# EasyEDA Pro project ProProject_BUCK_t1_3_2024-04-06.epro

# Schematic Schematic1
Create Date: 2024-04-03; Page Name: P1; Project Name: BUCK_t1_3; Schematic Name: Schematic1; Update Date: 2024-04-03; Company: 嘉立创EDA; Page Size: A3; Version: V1.0
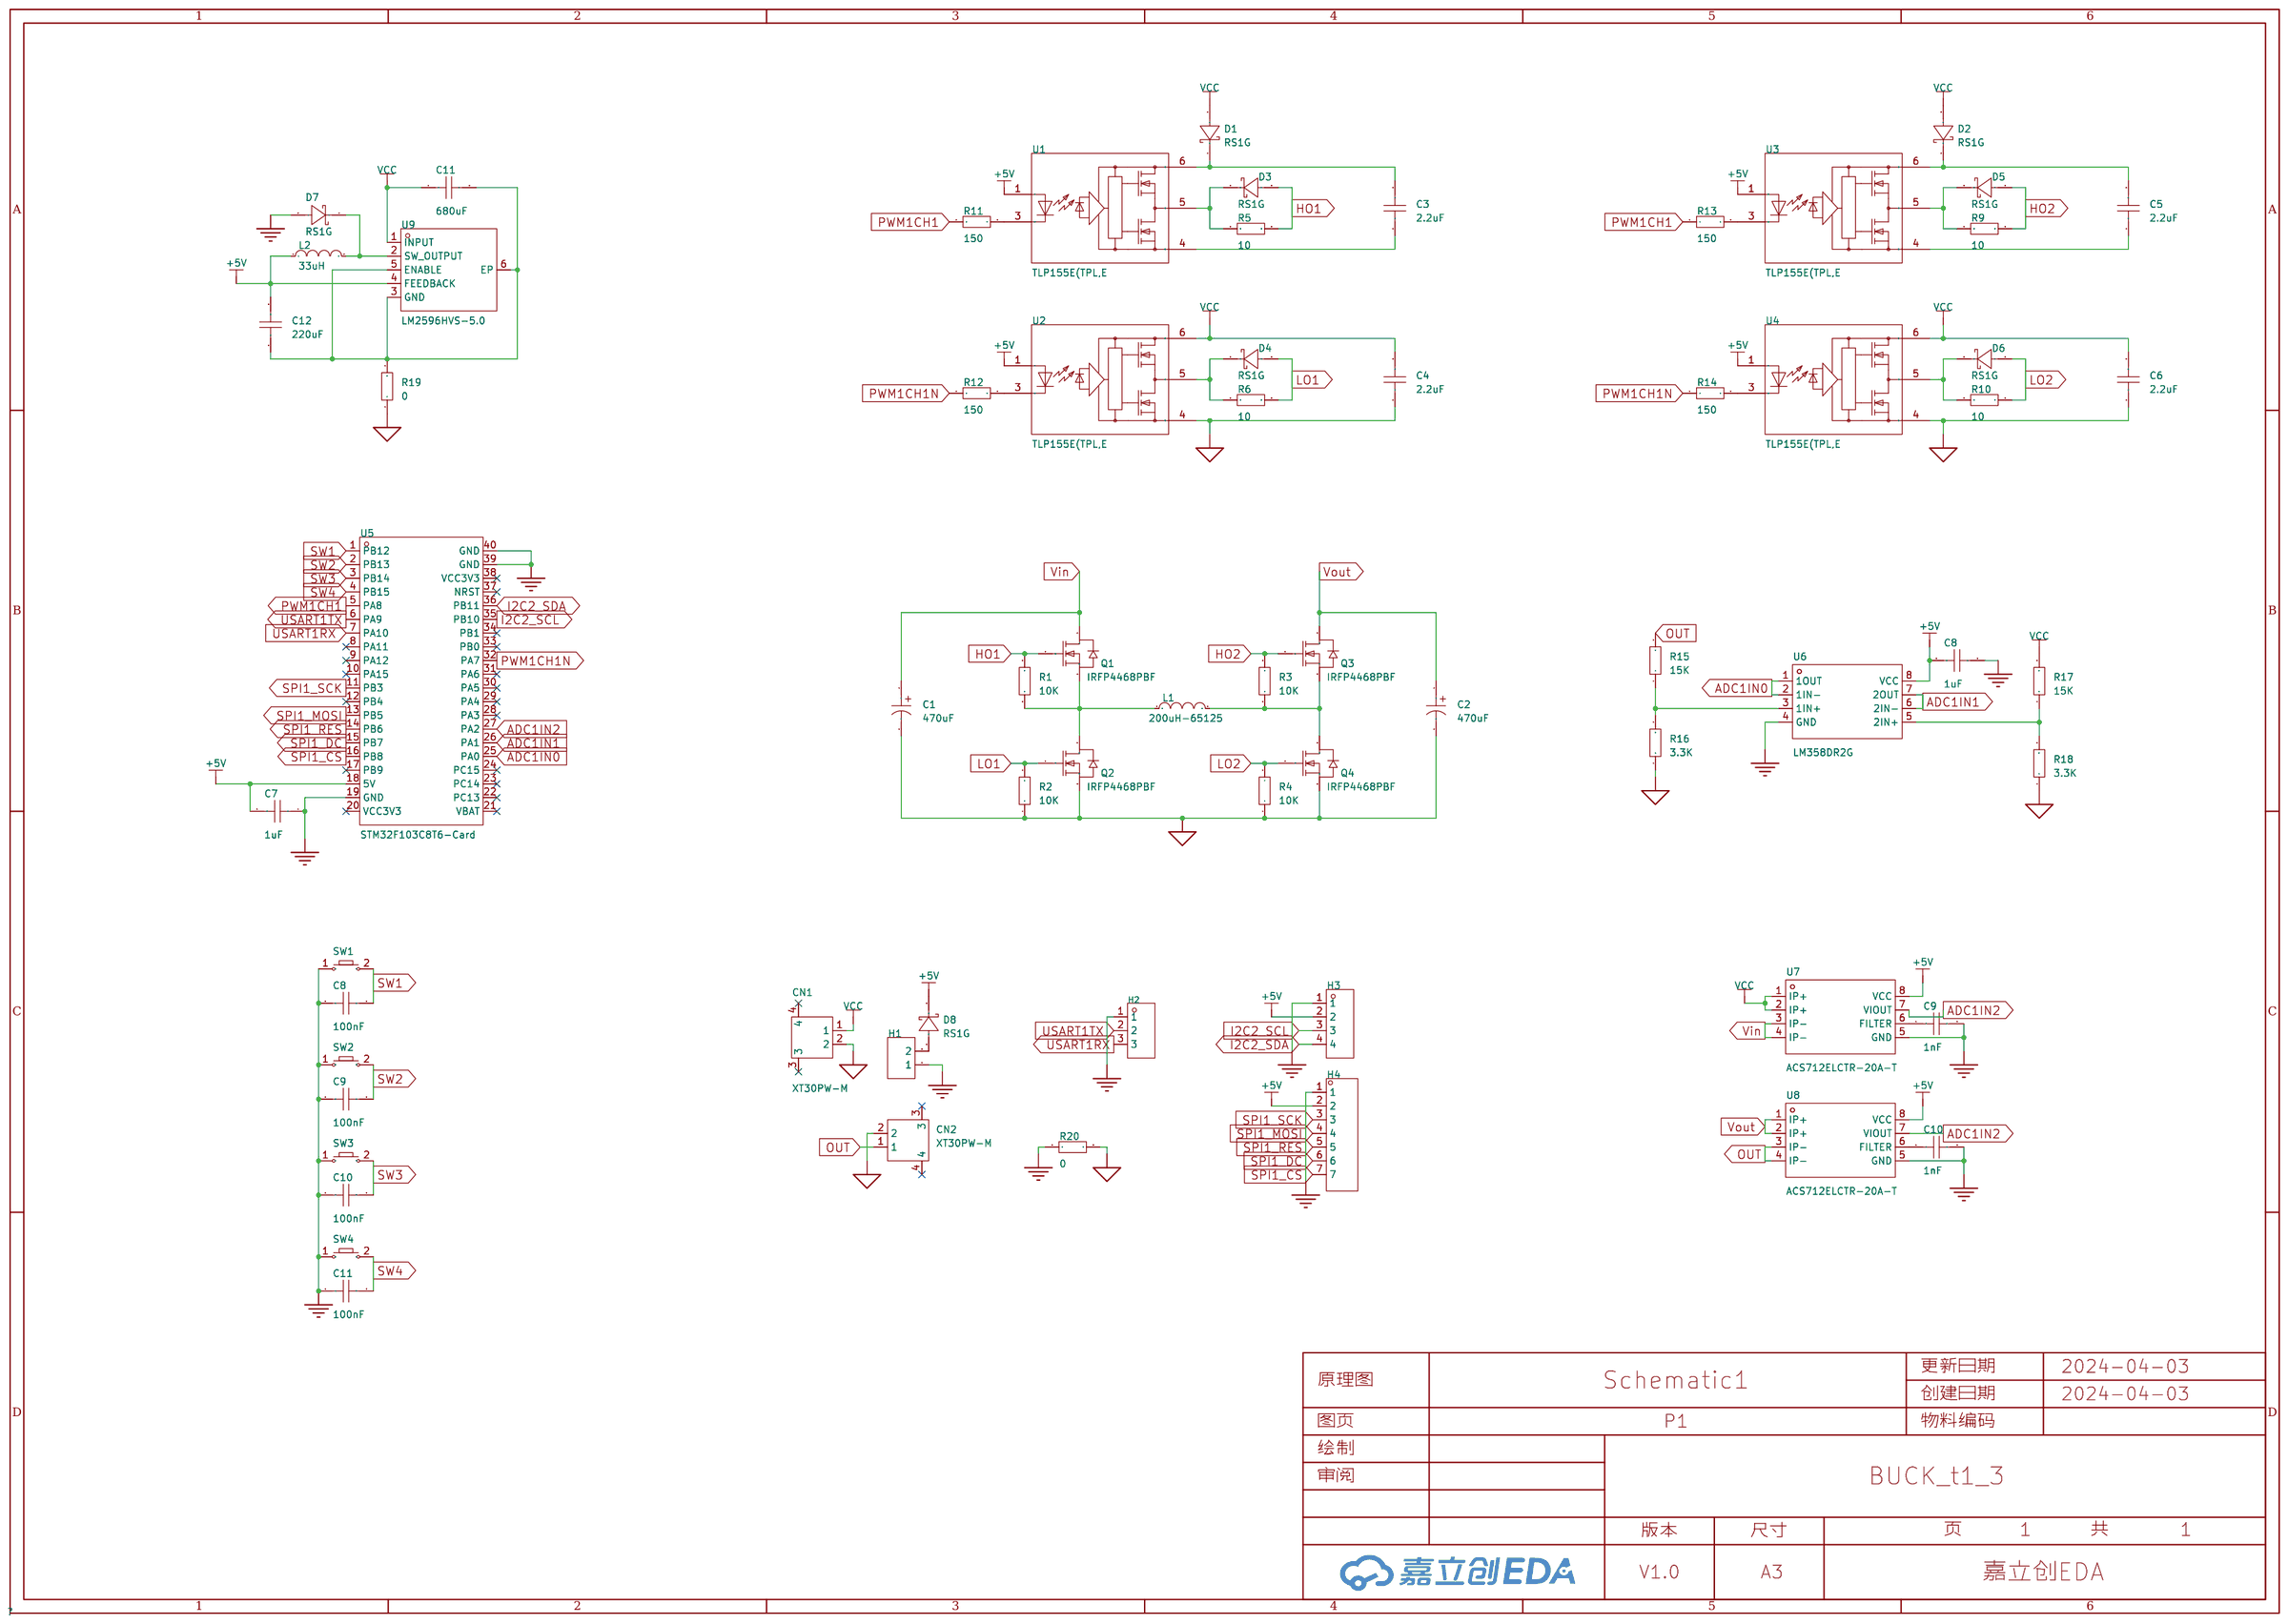
[diagram p0: schematic sheet]

## Parts
C1  470uF  [CAP-TH_BD16.0-P7.50-D1.5-FD]
C2  470uF  [CAP-TH_BD16.0-P7.50-D1.5-FD]
C3  2.2uF  [C0603]
C4  2.2uF  [C0603]
C5  2.2uF  [C0603]
C6  2.2uF  [C0603]
C7  1uF  [C0603]
C8  100nF  [C0603]
C8#2  1uF  [C0603]
C9  1nF  [C0603]
C9#2  100nF  [C0603]
C10  100nF  [C0603]
C10#2  1nF  [C0603]
C11  680uF  [C0603]
C11#2  100nF  [C0603]
C12  220uF  [C0603]
CN1  XT30PW-M  [CONN-TH_XT30PW-M]
CN2  XT30PW-M  [CONN-TH_XT30PW-M]
D1  RS1G  [SMA_L4.5-W2.7-LS5.0-RD]
D2  RS1G  [SMA_L4.5-W2.7-LS5.0-RD]
D3  RS1G  [SMA_L4.5-W2.7-LS5.0-RD]
D4  RS1G  [SMA_L4.5-W2.7-LS5.0-RD]
D5  RS1G  [SMA_L4.5-W2.7-LS5.0-RD]
D6  RS1G  [SMA_L4.5-W2.7-LS5.0-RD]
D7  RS1G  [SMA_L4.5-W2.7-LS5.0-RD]
D8  RS1G  [SMA_L4.5-W2.7-LS5.0-RD]
H1  -  [HDR-TH_2P-P2.54-V-F]
H2  -  [HDR-TH_3P-P2.54-V-F]
H3  -  [HDR-TH_4P-P2.54-V-F]
H4  -  [HDR-TH_7P-P2.54-V-F]
L1  200uH-65125  [IND-TH_200UH-65125]
L2  33uH  [IND-SMD_L7.3-W6.7_TMPA0605SV]
Q1  IRFP4468PBF  [TO-247AC-3_L15.8-W5.0-P5.46-L]
Q2  IRFP4468PBF  [TO-247AC-3_L15.8-W5.0-P5.46-L]
Q3  IRFP4468PBF  [TO-247AC-3_L15.8-W5.0-P5.46-L]
Q4  IRFP4468PBF  [TO-247AC-3_L15.8-W5.0-P5.46-L]
R1  10K  [R0603]
R2  10K  [R0603]
R3  10K  [R0603]
R4  10K  [R0603]
R5  10  [R0603]
R6  10  [R0603]
R9  10  [R0603]
R10  10  [R0603]
R11  150  [R0603]
R12  150  [R0603]
R13  150  [R0603]
R14  150  [R0603]
R15  15K  [R0603]
R16  3.3K  [R0603]
R17  15K  [R0603]
R18  3.3K  [R0603]
R19  0  [R0603]
R20  0  [R0603]
SW1  -  [Key_SMD_3x4x2]
SW2  -  [Key_SMD_3x4x2]
SW3  -  [Key_SMD_3x4x2]
SW4  -  [Key_SMD_3x4x2]
U1  TLP155E(TPL,E  [OPTO-SMD-5_L3.7-W4.6-P1.27-LS7.0-BR]
U2  TLP155E(TPL,E  [OPTO-SMD-5_L3.7-W4.6-P1.27-LS7.0-BR]
U3  TLP155E(TPL,E  [OPTO-SMD-5_L3.7-W4.6-P1.27-LS7.0-BR]
U4  TLP155E(TPL,E  [OPTO-SMD-5_L3.7-W4.6-P1.27-LS7.0-BR]
U5  STM32F103C8T6-Card  [CONN-TH_L53.3-W22.9_STM32F103C8T6-CARD]
U6  LM358DR2G  [SOIC-8_L5.0-W4.0-P1.27-LS6.0-BL]
U7  ACS712ELCTR-20A-T  [SOIC-8_L4.9-W3.9-P1.27-LS6.0-BL]
U8  ACS712ELCTR-20A-T  [SOIC-8_L4.9-W3.9-P1.27-LS6.0-BL]
U9  LM2596HVS-5.0  [TO-263-5_L10.0-W9.0-P1.70-LS15.0-BL]

## Library data of the parts
C1 C2 = ERS2BM471L35OT: 容值:470uF;精度:±20%;额定电压:120V;纹波电流:-;等效串联电阻:-;; LCSC Part Name: 470uF ±20% 120V; Supplier Part: C724648; Manufacturer: AISHI(艾华集团); Supplier Footprint: 插件,D16xL35mm; JLCPCB Part Class: 扩展库; Datasheet: https://atta.szlcsc.com/upload/public/pdf/source/20191015/C438940_4B8E60A742BB0AE40DDEF87A5C89089D.pdf; Supplier: LCSC; Tolerance: ±20%; Rated Voltage: 120V
C3-C8 C8#2 C9 C9#2 C10 C10#2 C11 C11#2 C12 = CAP_0603: Supplier Footprint: 0603
CN1 CN2 = XT30PW-M: 类别:-;类型1:-;; LCSC Part Name: AMASS(艾迈斯)航模插头 卧式弯脚 XT30PW-M公头; Supplier Part: C431092; Manufacturer: AMASS(艾迈斯); JLCPCB Part Class: 扩展库; Datasheet: https://atta.szlcsc.com/upload/public/pdf/source/20220222/6A9F22F7850E25B33E1BE430ADF8560B.pdf; Supplier: LCSC; Brand: 艾迈斯; Type: 航模插头; RatedVoltage: DC 500V; InterfaceType: 公头; RatedCurrent: 15A; RecommendedWireGauge: 16/18/20AWG; contact resistance: 1.2mΩ; specifications: 2pin
D1-D8 = RS1G: 正向压降(Vf):1.3V;直流反向耐压(Vr):400V;平均整流电流(Io):1A;反向恢复时间(trr):150ns;; LCSC Part Name: 电压:400V 电流:1A; Supplier Part: C3033524; Manufacturer: DIYI(迪一/芯诺); Supplier Footprint: SMA; JLCPCB Part Class: Extended Part; Datasheet: https://atta.szlcsc.com/upload/public/pdf/source/20220613/C965765CDFC32938B4D63EA677203AB8.pdf; Supplier: LCSC; Forward Voltage (Vf@If): 1.3V; Reverse Voltage (Vr): 400V; Average Rectified Current (Io): 1A; Reverse Leakage Current: 5uA; Reverse Recovery Time (trr): 150ns; Operating Temperature: -55℃~+150℃; Diode Configuration: 独立式
H1 = HDR-F_2.54_1x2P: Supplier Part: C49661; Supplier Footprint: 插件
H2 = HDR-F_2.54_1x3P: Supplier Part: C541850; Supplier Footprint: 插件
H3 = HDR-F_2.54_1x4P: Supplier Part: C2718488; Supplier Footprint: 插件
H4 = HDR-F_2.54_1x7P: Supplier Part: C124418; Supplier Footprint: 插件
L1 = 200uH-65125: Supplier Part: C9900012734; Supplier Footprint: IND-TH; JLCPCB Part Class: Extended Part; Supplier: LCSC
L2 = MGV0603330M-10: 电感值:33uH;精度:±20%;额定电流:2A;饱和电流(Isat):2.5A;类型:-;; LCSC Part Name: 33uH ±20% 2.5A; Supplier Part: C2453970; Manufacturer: Laird-Signal Integrity Products; JLCPCB Part Class: Extended Part; Datasheet: https://atta.szlcsc.com/upload/public/pdf/source/20210416/42953FF7012EE029E7A94AFFA1C1F7D2.pdf; Supplier: LCSC; Tolerance: ±20%; Rated Current: 2A; Saturation Current (Isat): 2.5A; DC Resistance (DCR): 200mΩ
Q1-Q4 = IRFP4468PBF: 类型:N沟道;漏源电压(Vdss):100V;连续漏极电流(Id):195A;功率(Pd):520W;导通电阻(RDS(on)@Vgs,Id):2.6mΩ@10V,180A;阈值电压(Vgs(th)@Id):4V@250uA;; LCSC Part Name: N沟道 耐压:100V 电流:195A; Supplier Part: C2919; Manufacturer: Infineon(英飞凌); Supplier Footprint: TO-247AC-3; JLCPCB Part Class: 扩展库; Datasheet: https://atta.szlcsc.com/upload/public/pdf/source/20200421/C513172_0206954A6A294F6A4994DAF9F319B5AC.pdf; Supplier: LCSC; Type: N沟道; Drain Source Voltage (Vdss): 100V; Continuous Drain Current (Id): 195A; Power Dissipation (Pd): 520W; Drain Source On Resistance (RDS(on)@Vgs,Id): 2.6mΩ@10V,180A; Gate Threshold Voltage (Vgs(th)@Id): 4V@250uA; Total Gate Charge (Qg@Vgs): 540nC@10V; Input Capacitance (Ciss@Vds): 19.86nF@50V; Operating Temperature: -55℃~+175℃@(Tj)
R1-R6 R9-R20 = Res_0603: Supplier Footprint: 0603
SW1-SW4 = Key_SMD_3x4x2: Supplier Footprint: SMD
U1-U4 = TLP155E(TPL,E: 输入类型:DC;电源电压:10V~30V;共模瞬变抗扰度CMTI:15kV/us;传播延迟tpLH/tpHL:170ns；170ns;; Supplier Part: C56499; Manufacturer: TOSHIBA(东芝); Supplier Footprint: SOIC-5-4.6mm; JLCPCB Part Class: 扩展库; Datasheet: https://atta.szlcsc.com/upload/public/pdf/source/20150821/1457707350132.pdf; Supplier: LCSC; Input Type: DC; Supply Voltage: 10V~30V; Common Mode Transient Immunity (CMTI): 15kV/us; Propagation Delay tpLH/tpHL: 170ns；170ns; Number of Channels: 1; Operating Temperature: -40℃~+100℃
U5 = STM32F103C8T6-Card: Supplier Part: C9900077949; Supplier Footprint: 插件; Supplier: LCSC
U6 = LM358DR2G: 放大器数:双路;增益带宽积(GBP):1MHz;输入偏置电流(Ib):45nA;压摆率(SR):-;带宽(-3db):-;; LCSC Part Name: LM358DR2G 运算放大器，单电源，双路; Supplier Part: C7950; Manufacturer: onsemi(安森美); Supplier Footprint: SOIC-8; JLCPCB Part Class: 基础库; Datasheet: https://atta.szlcsc.com/upload/public/pdf/source/20150124/1457707258826.pdf; Supplier: LCSC; Number of Circuits: 双路; Gain Bandwidth Product(GBP): 1MHz; Current - Input Bias(Ib): 45nA; Output Current: 40mA; Supply Current: 1.5mA; Operating Temperature: 0℃~+70℃
U7 U8 = ACS712ELCTR-20A-T: 电流测量范围:20A;灵敏度:100mV/A;; Supplier Part: C10681; Manufacturer: ALLEGRO(美国埃戈罗); Supplier Footprint: SOIC-8; JLCPCB Part Class: 扩展库; Datasheet: https://atta.szlcsc.com/upload/public/pdf/source/20130706/1457706622210.pdf; Supplier: LCSC; Current Range: 20A; Supply Voltage: 5V; Sensitivity: 100mV/A; Operating Temperature: -40℃~+85℃
U9 = LM2596HVS-5.0_C18197847: Supplier Part: C18197847; Manufacturer: TECH PUBLIC(台舟); Supplier Footprint: TO-263-5L; Datasheet: https://atta.szlcsc.com/upload/public/pdf/source/20231008/EF2B5CCB8589235E578FFA43C9351D8A.pdf; Supplier: LCSC

## Nets
+5V: C7.2 C8#2.1 C12.2 D8.1(K) H3.2 H4.2 L2.1 U1.1(AN) U2.1(AN) U3.1(AN) U4.1(AN) U5.18(5V) U6.8(VCC) U7.8(VCC) U8.8(VCC) U9.4(FEEDBACK)
AGND: C1.2 C2.2 C4.1 C6.1 CN1.2 CN2.2 Q2.3(S) Q4.3(S) R2.1 R4.1 R16.1 R18.1 R19.1 R20.2 U2.4(GND) U4.4(GND)
GND: C7.1 C8.1 C8#2.2 C9.2 C9#2.1 C10.1 C10#2.2 C11#2.1 D7.2(A) H1.1 H2.1 H3.1 H4.1 R20.1 SW1.1 SW2.1 SW3.1 SW4.1 U5.19(GND) U5.39(GND) U5.40(GND) U6.4(GND) U7.5(GND) U8.5(GND)
VCC: C4.2 C6.2 C11.1 CN1.1 D1.2(A) D2.2(A) R17.2 U2.6(VCC) U4.6(VCC) U7.1(IP+) U7.2(IP+) U9.1(INPUT)
Vin: C1.1 Q1.2(D) U7.3(IP-) U7.4(IP-)
ADC1IN0: U5.25(PA0) U6.1(1OUT) U6.2(1IN-)
ADC1IN1: U5.26(PA1) U6.6(2IN-) U6.7(2OUT)
ADC1IN2: U5.27(PA2) U7.7(VIOUT) U8.7(VIOUT)
HO1: D3.2(A) Q1.1(G) R1.2 R5.2
HO2: D5.2(A) Q3.1(G) R3.2 R9.2
I2C2_SCL: H3.3 U5.35(PB10)
I2C2_SDA: H3.4 U5.36(PB11)
LO1: D4.2(A) Q2.1(G) R2.2 R6.2
LO2: D6.2(A) Q4.1(G) R4.2 R10.2
OUT: CN2.1 R15.2 U8.3(IP-) U8.4(IP-)
PWM1CH1: R11.1 R13.1 U5.5(PA8)
PWM1CH1N: R12.1 R14.1 U5.32(PA7)
SPI1_CS: H4.7 U5.16(PB8)
SPI1_DC: H4.6 U5.15(PB7)
SPI1_MOSI: H4.4 U5.13(PB5)
SPI1_RES: H4.5 U5.14(PB6)
SPI1_SCK: H4.3 U5.11(PB3)
SW1: C8.2 SW1.2 U5.1(PB12)
SW2: C9#2.2 SW2.2 U5.2(PB13)
SW3: C10.2 SW3.2 U5.3(PB14)
SW4: C11#2.2 SW4.2 U5.4(PB15)
USART1RX: H2.3 U5.7(PA10)
USART1TX: H2.2 U5.6(PA9)
Vout: C2.1 Q3.2(D) U8.1(IP+) U8.2(IP+)
$1N1495: C3.1 U1.4(GND)
Net-(C3-2): C3.2 D1.1(K) U1.6(VCC)
Net-(C5-1): C5.1 U3.4(GND)
Net-(C5-2): C5.2 D2.1(K) U3.6(VCC)
Net-(C9-1): C9.1 U7.6(FILTER)
Net-(C10#2-1): C10#2.1 U8.6(FILTER)
Net-(C11-2): C11.2 C12.1 R19.2 U9.3(GND) U9.5(ENABLE) U9.6(EP)
Net-(D3-1): D3.1(K) R5.1 U1.5(VO)
Net-(D4-1): D4.1(K) R6.1 U2.5(VO)
Net-(D5-1): D5.1(K) R9.1 U3.5(VO)
Net-(D6-1): D6.1(K) R10.1 U4.5(VO)
Net-(D7-1): D7.1(K) L2.2 U9.2(SW_OUTPUT)
Net-(D8-2): D8.2(A) H1.2
Net-(L1-1): L1.1 Q1.3(S) Q2.2(D) R1.1
Net-(L1-2): L1.2 Q3.3(S) Q4.2(D) R3.1
Net-(R11-2): R11.2 U1.3(CAT)
Net-(R12-2): R12.2 U2.3(CAT)
Net-(R13-2): R13.2 U3.3(CAT)
Net-(R14-2): R14.2 U4.3(CAT)
Net-(R15-1): R15.1 R16.2 U6.3(1IN+)
Net-(R17-1): R17.1 R18.2 U6.5(2IN+)

Not connected (* = marked no-connect by the designer): CN1 3* 4*; CN2 3* 4*; U5 8(PA11)* 9(PA12)* 10(PA15)* 12(PB4)* 17(PB9)* 20(VCC3V3)* 21(VBAT)* 22(PC13)* 23(PC14)* 24(PC15)* 28(PA3)* 29(PA4)* 30(PA5)* 31(PA6)* 33(PB0)* 34(PB1)* 37(NRST)* 38(VCC3V3)*

# Board PCB1
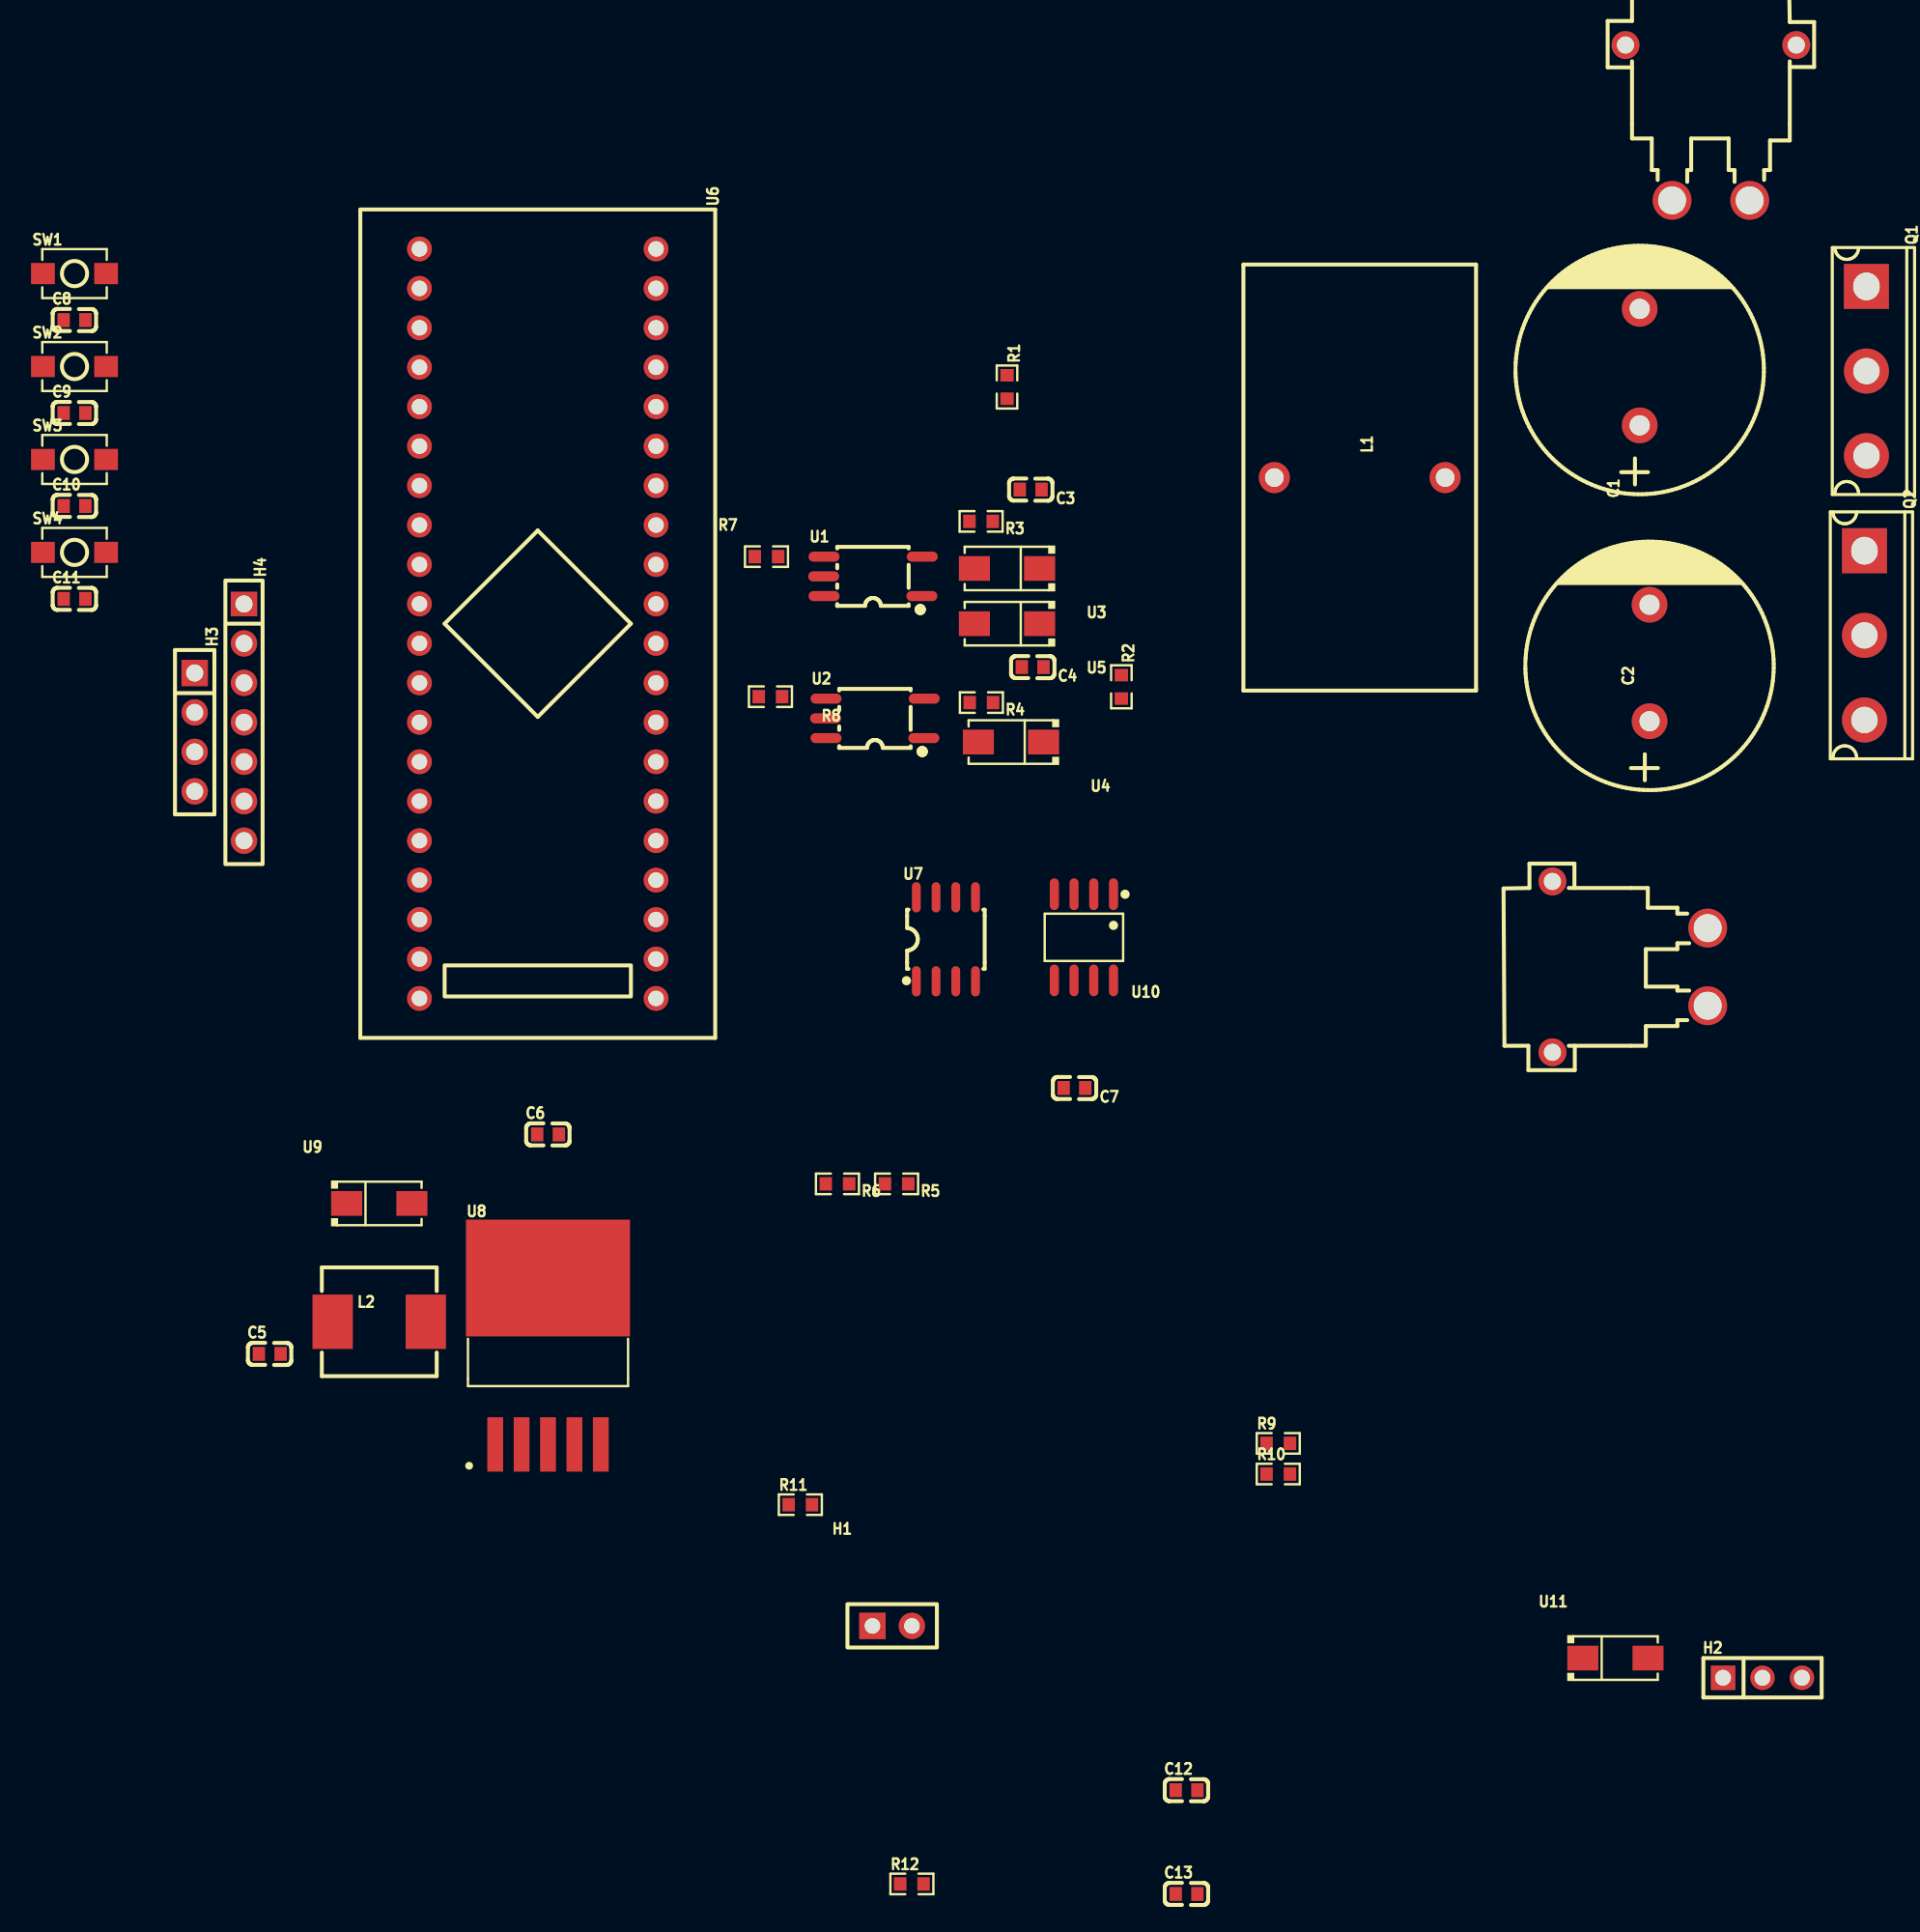
[diagram p1: board, top side]
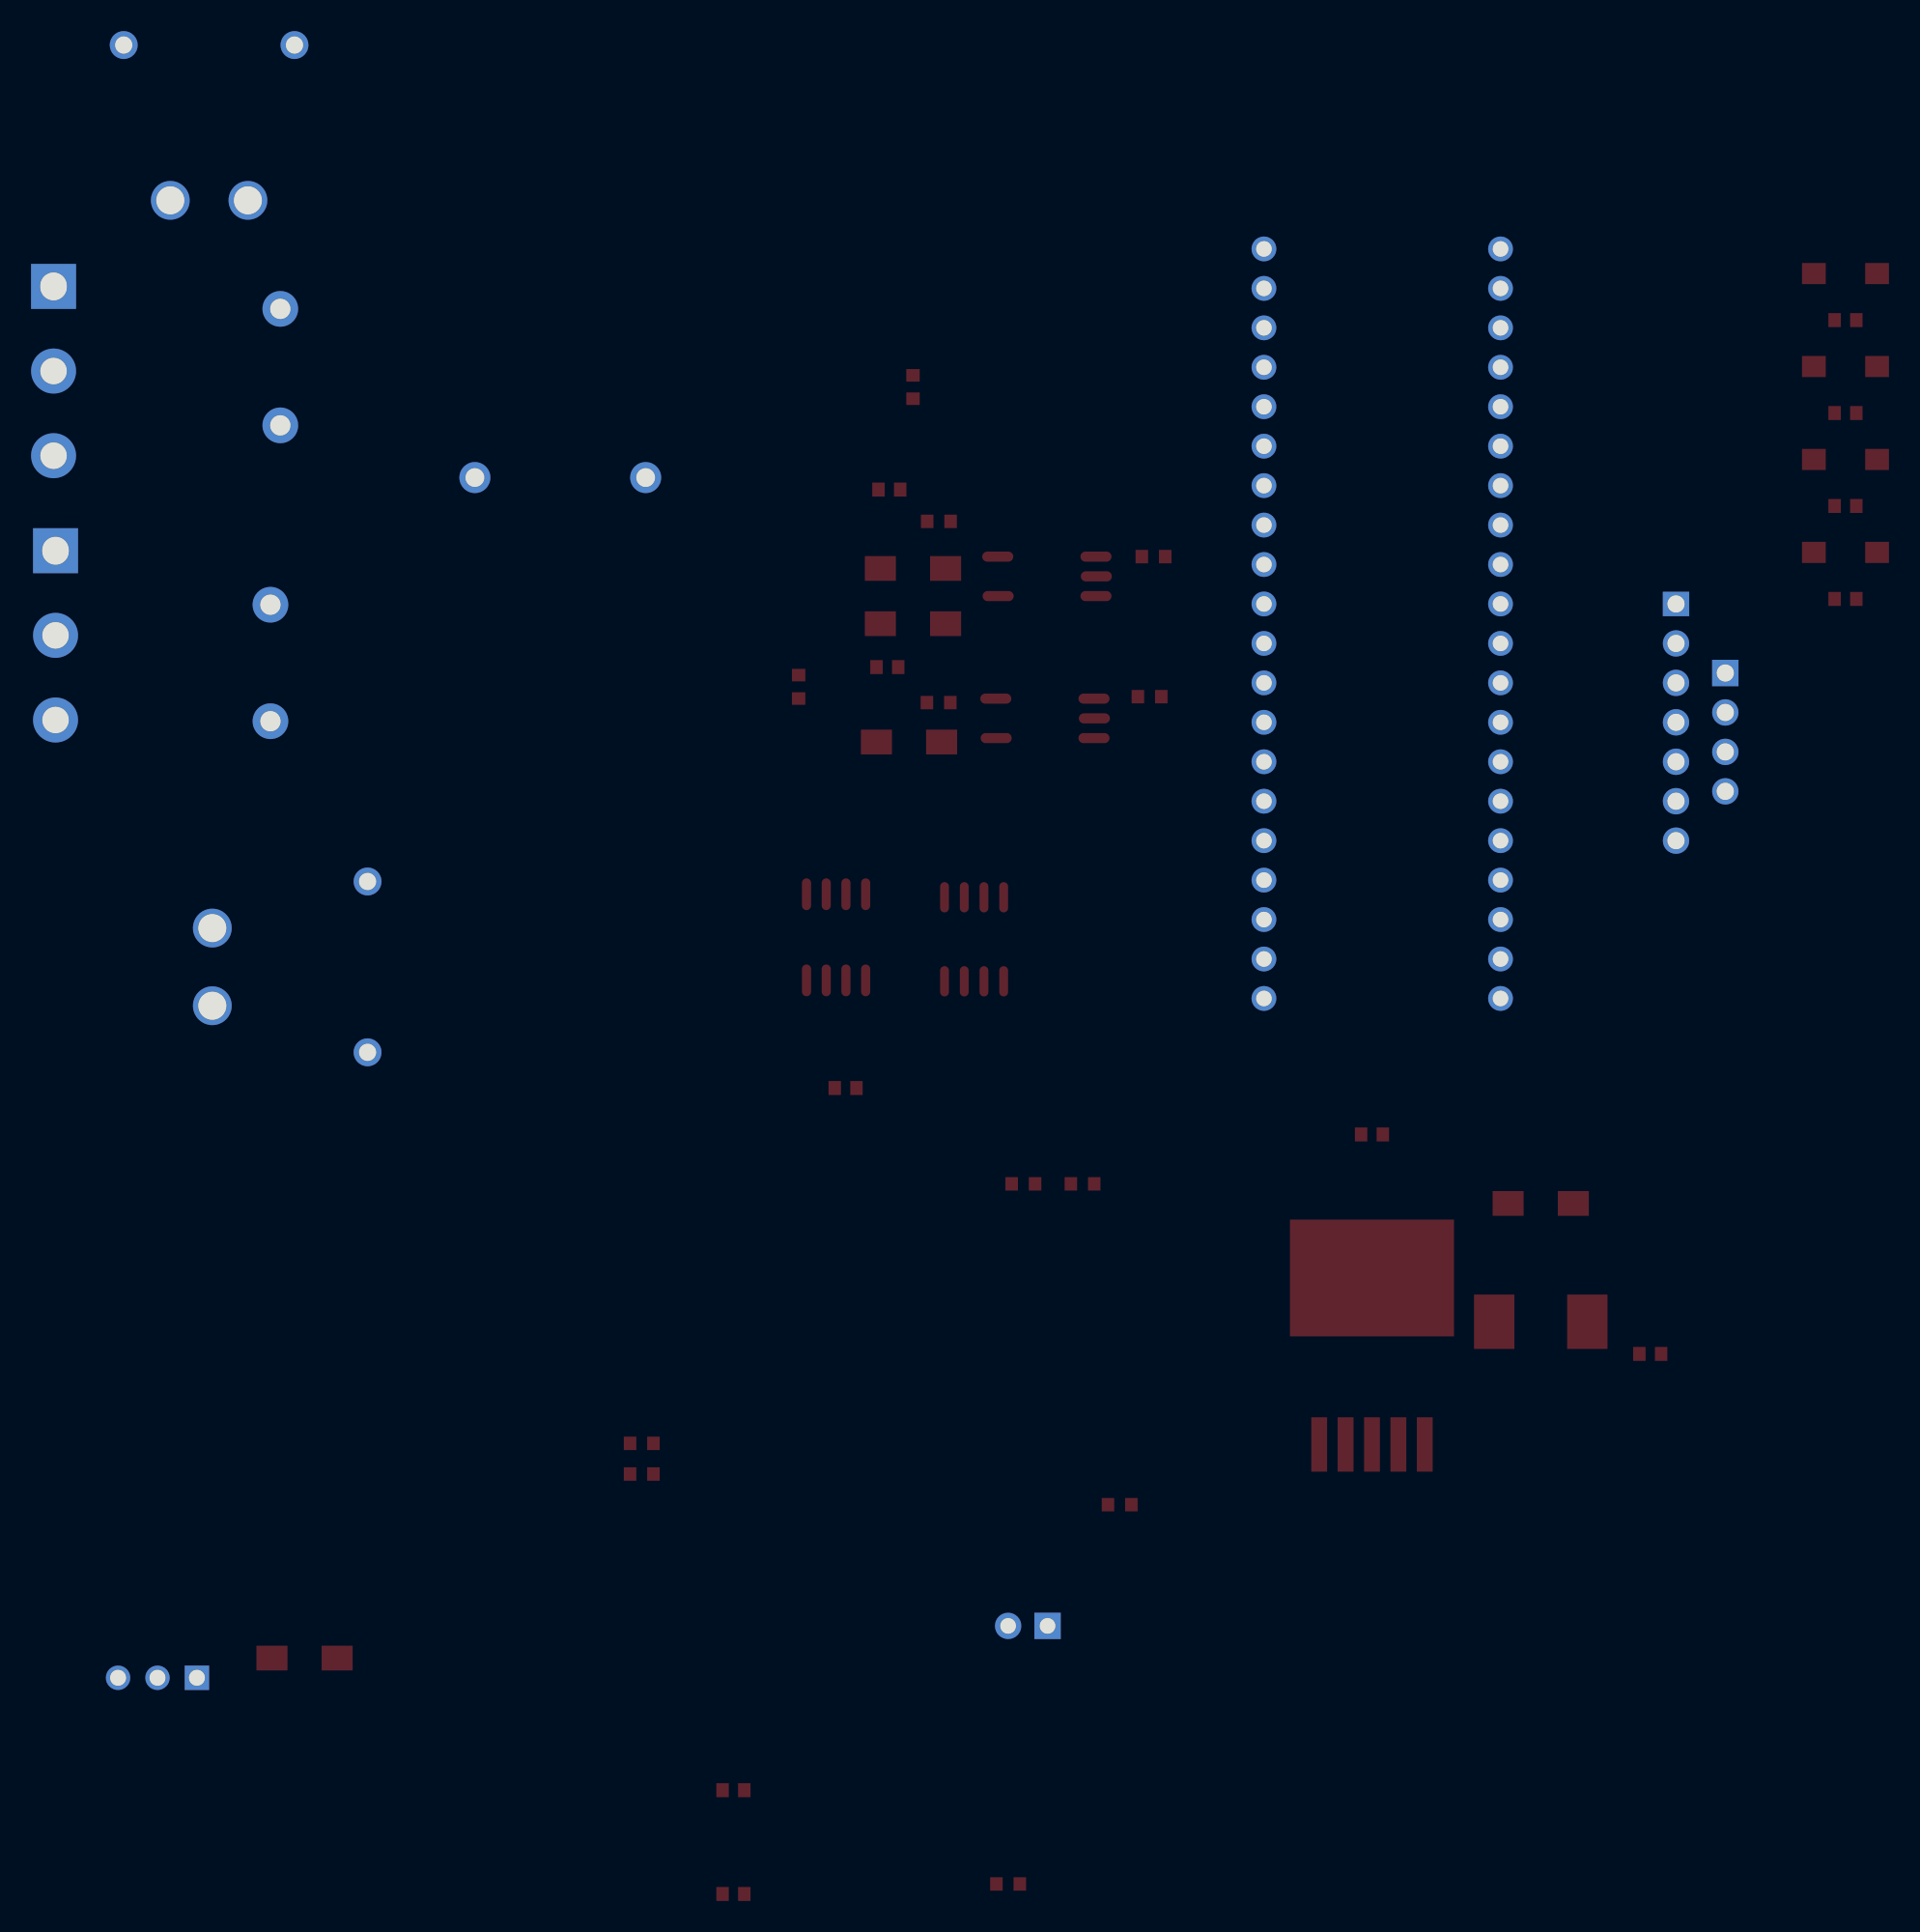
[diagram p2: board, bottom side, seen from below]

No outline. copper layers: Top Layer, Bottom Layer. Coordinates in mm from the lowest, leftmost part position.
Stack: Top Layer 0.035mm / Dielectric1 1.51mm FR4 er 4.5 / Bottom Layer 0.035mm

## Design rules (mm)
template: JLCPCB Capability(Two Layers Board)
spacing copperThickness1oz (default): track to track 0.102, other pairs 0.152 to 0.3
spacing copperThickness2oz: track to track 0.203, other pairs 0.152 to 0.3
track width copperThickness1oz (default): min 0.127, default 0.254, max 2.54
track width copperThickness2oz: min 0.203, default 0.254, max 2.54
differential pair differentialPair (default): width min 0.127, default 0.254, max 2.54; gap min 0.152, default 0.152
via viaSize (default): diameter min 0.5, default 0.61, max 10; hole min 0.3, default 0.305, max 6.3

## Placement (name value [footprint] x y rotation side)
C1  470uF  [CAP-TH_BD16.0-P7.50-D1.5-FD]  100.82 98.31 90 top
C2  470uF  [CAP-TH_BD16.0-P7.50-D1.5-FD]  101.45 79.26 90 top
C3  2.2uF  [C0603]  61.59 90.43 180 top
C4  2.2uF  [C0603]  61.72 79 180 top
C5  2.2uF  [C0603]  12.58 34.77 0 top
C6  2.2uF  [C0603]  30.5 48.9 0 top
C7  1uF  [C0603]  64.41 51.89 180 top
C8  100nF  [C0603]  0 101.34 0 top
C9  1nF  [C0603]  0 95.35 0 top
C10  100nF  [C0603]  0 89.37 0 top
C11  680uF  [C0603]  0 83.38 0 top
C12  220uF  [C0603]  71.63 6.68 0 top
C13  1uF  [C0603]  71.63 0 0 top
CN1  XT30PW-M  [CONN-TH_XT30PW-M]  105.4 114.05 180 top
CN2  XT30PW-M  [CONN-TH_XT30PW-M]  100.2 59.69 270 top
H1  -  [HDR-TH_2P-P2.54-V-F]  52.67 17.26 0 top
H2  -  [HDR-TH_3P-P2.54-V-F]  108.73 13.92 0 top
H3  -  [HDR-TH_4P-P2.54-V-F]  7.74 74.8 270 top
H4  -  [HDR-TH_7P-P2.54-V-F]  10.92 75.44 270 top
L1  200uH-65125  [IND-TH_200UH-65125]  82.78 91.2 270 top
L2  33uH  [IND-SMD_L7.3-W6.7_TMPA0605SV]  19.63 36.84 0 top
Q1  IRFP4468PBF  [TO-247AC-3_L15.8-W5.0-P5.46-L]  115.42 98.06 270 top
Q2  IRFP4468PBF  [TO-247AC-3_L15.8-W5.0-P5.46-L]  115.3 81.04 270 top
R1  10K  [R0603]  60.06 97.03 270 top
R2  10K  [R0603]  67.43 77.73 270 top
R3  10K  [R0603]  58.4 88.38 180 top
R4  10K  [R0603]  58.41 76.71 180 top
R5  10  [R0603]  52.95 45.72 180 top
R6  10  [R0603]  49.14 45.72 180 top
R7  150  [R0603]  44.57 86.11 0 top
R8  150  [R0603]  44.82 77.09 180 top
R9  10  [R0603]  77.54 29.01 0 top
R10  10  [R0603]  77.54 27.04 0 top
R11  150  [R0603]  46.75 25.06 0 top
R12  150  [R0603]  53.94 0.64 0 top
SW1  -  [Key_SMD_3x4x2]  0 104.33 0 top
SW2  -  [Key_SMD_3x4x2]  0 98.35 0 top
SW3  -  [Key_SMD_3x4x2]  0 92.36 0 top
SW4  -  [Key_SMD_3x4x2]  0 86.38 0 top
U1  TLP155E(TPL,E  [OPTO-SMD-5_L3.7-W4.6-P1.27-LS7.0-BR]  51.43 84.84 0 top
U2  TLP155E(TPL,E  [OPTO-SMD-5_L3.7-W4.6-P1.27-LS7.0-BR]  51.56 75.69 0 top
U3  TLP155E(TPL,E  [SMA_L4.3-W2.5-LS5.0-RD]  60.06 85.35 180 top
U4  TLP155E(TPL,E  [SMA_L4.3-W2.5-LS5.0-RD]  60.32 74.17 180 top
U5  STM32F103C8T6-Card  [SMA_L4.3-W2.5-LS5.0-RD]  60.06 81.79 180 top
U6  LM358DR2G  [CONN-TH_L53.3-W22.9_STM32F103C8T6-CARD]  29.84 81.79 270 top
U7  ACS712ELCTR-20A-T  [SOIC-8_L5.0-W4.0-P1.27-LS6.0-BL]  56.13 61.47 0 top
U8  ACS712ELCTR-20A-T  [TO-263-5_L10.0-W9.0-P1.70-LS15.0-BL]  30.5 34.3 0 top
U9  LM2596HVS-5.0  [SMA_L4.3-W2.5-LS5.0-RD]  19.63 44.46 0 top
U10  ACS712ELCTR-20A-T  [SOIC-8_L4.9-W3.9-P1.27-LS6.0-BL]  65.02 61.6 180 top
U11  RS1A  [SMA_L4.3-W2.5-LS5.0-RD]  99.26 15.19 0 top

## Footprints (pads in the part's own frame, mm; a bottom-side part is the same pattern mirrored in y, then rotated)
C0603
  rect 0.8x0.9 smd: 1(-0.7,0) 2(0.7,0)
CAP-TH_BD16.0-P7.50-D1.5-FD
  round 2.3 hole 1.3: 1(-3.75,0) 2(3.75,0)
CONN-TH_L53.3-W22.9_STM32F103C8T6-CARD
  round 1.6 hole 1: 1(-24.13,-7.62) 2(-21.59,-7.62) 3(-19.05,-7.62) 4(-16.51,-7.62) 5(-13.97,-7.62) 6(-11.43,-7.62) 7(-8.89,-7.62) 8(-6.35,-7.62) 9(-3.81,-7.62) 10(-1.27,-7.62) 11(1.27,-7.62) 12(3.81,-7.62) 13(6.35,-7.62) 14(8.89,-7.62) 15(11.43,-7.62) 16(13.97,-7.62) 17(16.51,-7.62) 18(19.05,-7.62) 19(21.59,-7.62) 20(24.13,-7.62) 21(24.13,7.62) 22(21.59,7.62) 23(19.05,7.62) 24(16.51,7.62) 25(13.97,7.62) 26(11.43,7.62) 27(8.89,7.62) 28(6.35,7.62) 29(3.81,7.62) 30(1.27,7.62) 31(-1.27,7.62) 32(-3.81,7.62) 33(-6.35,7.62) 34(-8.89,7.62) 35(-11.43,7.62) 36(-13.97,7.62) 37(-16.51,7.62) 38(-19.05,7.62) 39(-21.59,7.62) 40(-24.13,7.62)
CONN-TH_XT30PW-M
  round 2.5 hole 1.8: 1(-2.5,5) 2(2.5,5)
  round 1.8 hole 1.1: 3(5.5,-5) 4(-5.5,-5)
HDR-TH_2P-P2.54-V-F
  rect 1.7x1.7 hole 1: 1(-1.27,0)
  round 1.7 hole 1: 2(1.27,0)
HDR-TH_3P-P2.54-V-F
  rect 1.575x1.575 hole 1.02: 1(-2.54,0)
  round 1.575 hole 1.02: 2(0,0) 3(2.54,0)
HDR-TH_4P-P2.54-V-F
  rect 1.7x1.7 hole 1.1: 1(-3.81,0)
  round 1.7 hole 1.1: 2(-1.27,0) 3(1.27,0) 4(3.81,0)
HDR-TH_7P-P2.54-V-F
  rect 1.575x1.7 hole 1.1: 1(-7.62,0)
  round 1.7 hole 1.1: 2(-5.08,0) 3(-2.54,0) 4(0,0) 5(2.54,0) 6(5.08,0) 7(7.62,0)
IND-SMD_L7.3-W6.7_TMPA0605SV
  rect 2.6x3.5 smd: 1(-3,0) 2(3,0)
IND-TH_200UH-65125
  round 2 hole 1.2: 1(0,-5.5) 2(0,5.5)
Key_SMD_3x4x2
  rect 1.53x1.36 smd: 1(-2.035,0) 2(2.035,0)
OPTO-SMD-5_L3.7-W4.6-P1.27-LS7.0-BR
  oval 2x0.65 smd: 1(3.15,-1.27) 3(3.175,1.27) 4(-3.15,1.27) 5(-3.175,0) 6(-3.15,-1.27)
R0603
  rect 0.806x0.864 smd: 1(-0.753,0) 2(0.753,0)
SMA_L4.3-W2.5-LS5.0-RD
  rect 2x1.593 smd: 1(-2.1,0) 2(2.1,0)
SOIC-8_L4.9-W3.9-P1.27-LS6.0-BL
  oval 0.588x2.045 smd: 1(-1.905,-2.772) 2(-0.635,-2.772) 3(0.635,-2.772) 4(1.905,-2.772) 5(1.905,2.772) 6(0.635,2.772) 7(-0.635,2.772) 8(-1.905,2.772)
SOIC-8_L5.0-W4.0-P1.27-LS6.0-BL
  oval 0.569x1.95 smd: 1(-1.905,-2.705) 2(-0.635,-2.705) 3(0.635,-2.705) 4(1.905,-2.705) 5(1.905,2.705) 6(0.635,2.705) 7(-0.635,2.705) 8(-1.905,2.705)
TO-247AC-3_L15.8-W5.0-P5.46-L
  rect 2.9x2.9 hole 1.785x1.7: 1(-5.45,0)
  round 2.9 hole 1.7: 2(0,0) 3(5.45,0)
TO-263-5_L10.0-W9.0-P1.70-LS15.0-BL
  rect 1.02x3.5 smd: 1(-3.4,-5.36) 2(-1.7,-5.36) 3(0,-5.36) 4(1.7,-5.36) 5(3.4,-5.36)
  rect 10.566x7.521 smd: 6(0,5.36)

## Nets
+5V: C5.2 C12.1 C13.2 H3.2 H4.2 L2.1 U1.1 U2.1 U6.18 U7.8 U8.4 U10.8 U11.1
AGND: C1.2 C2.2 C4.1 CN1.2 CN2.2 Q2.3 R2.2 R6.1 R10.1 R11.1 R12.2 U2.4
GND: C7.2 C8.1 C9.1 C10.1 C11.1 C12.2 C13.1 H1.1 H2.1 H3.1 H4.1 R12.1 SW1.1 SW2.1 SW3.1 SW4.1 U6.19 U6.39 U6.40 U7.4 U9.2 U10.5
VCC: C1.1 C4.2 C6.1 CN1.1 Q1.2 R9.2 U2.6 U5.2 U8.1
ADC1IN0: U6.25 U7.1 U7.2
ADC1IN1: U6.26 U10.7
ADC1IN2: U6.27 U7.6 U7.7
HO: Q1.1 R1.1 R3.2 U3.2
I2C2_SCL: H3.3 U6.35
I2C2_SDA: H3.4 U6.36
LO: Q2.1 R2.1 R4.2 U4.2
OUT: CN2.1 R5.2 U10.3 U10.4
PWM1CH1: R7.1 U6.5
PWM1CH1N: R8.1 U6.32
SPI1_CS: H4.7 U6.16
SPI1_DC: H4.6 U6.15
SPI1_MOSI: H4.4 U6.13
SPI1_RES: H4.5 U6.14
SPI1_SCK: H4.3 U6.11
SW1: C8.2 SW1.2 U6.1
SW2: C9.2 SW2.2 U6.2
SW3: C10.2 SW3.2 U6.3
SW4: C11.2 SW4.2 U6.4
USART1RX: H2.3 U6.7
USART1TX: H2.2 U6.6
VOUT: C2.1 L1.2 U10.1 U10.2
$1N1041: L1.1 Q1.3 Q2.2 R1.2
$1N1235: R4.1 U2.5 U4.1
$1N1253: R3.1 U1.5 U3.1
$1N1489: C3.2 U1.6 U5.1
$1N1495: C3.1 U1.4
$1N2345: R5.1 R6.2 U7.3
$1N2939: L2.2 U8.2 U9.1
$1N3865: R7.2 U1.3
$1N3891: R8.2 U2.3
$1N4391: C7.1 U10.6
$1N4589: R9.1 R10.2 U7.5
$1N4694: C5.1 C6.2 R11.2 U8.3 U8.5 U8.6
$1N9881: H1.2 U11.2

Pads without a net: CN1 3 4; CN2 3 4; U6 8 9 10 12 17 20 21 22 23 24 28 29 30 31 33 34 37 38
